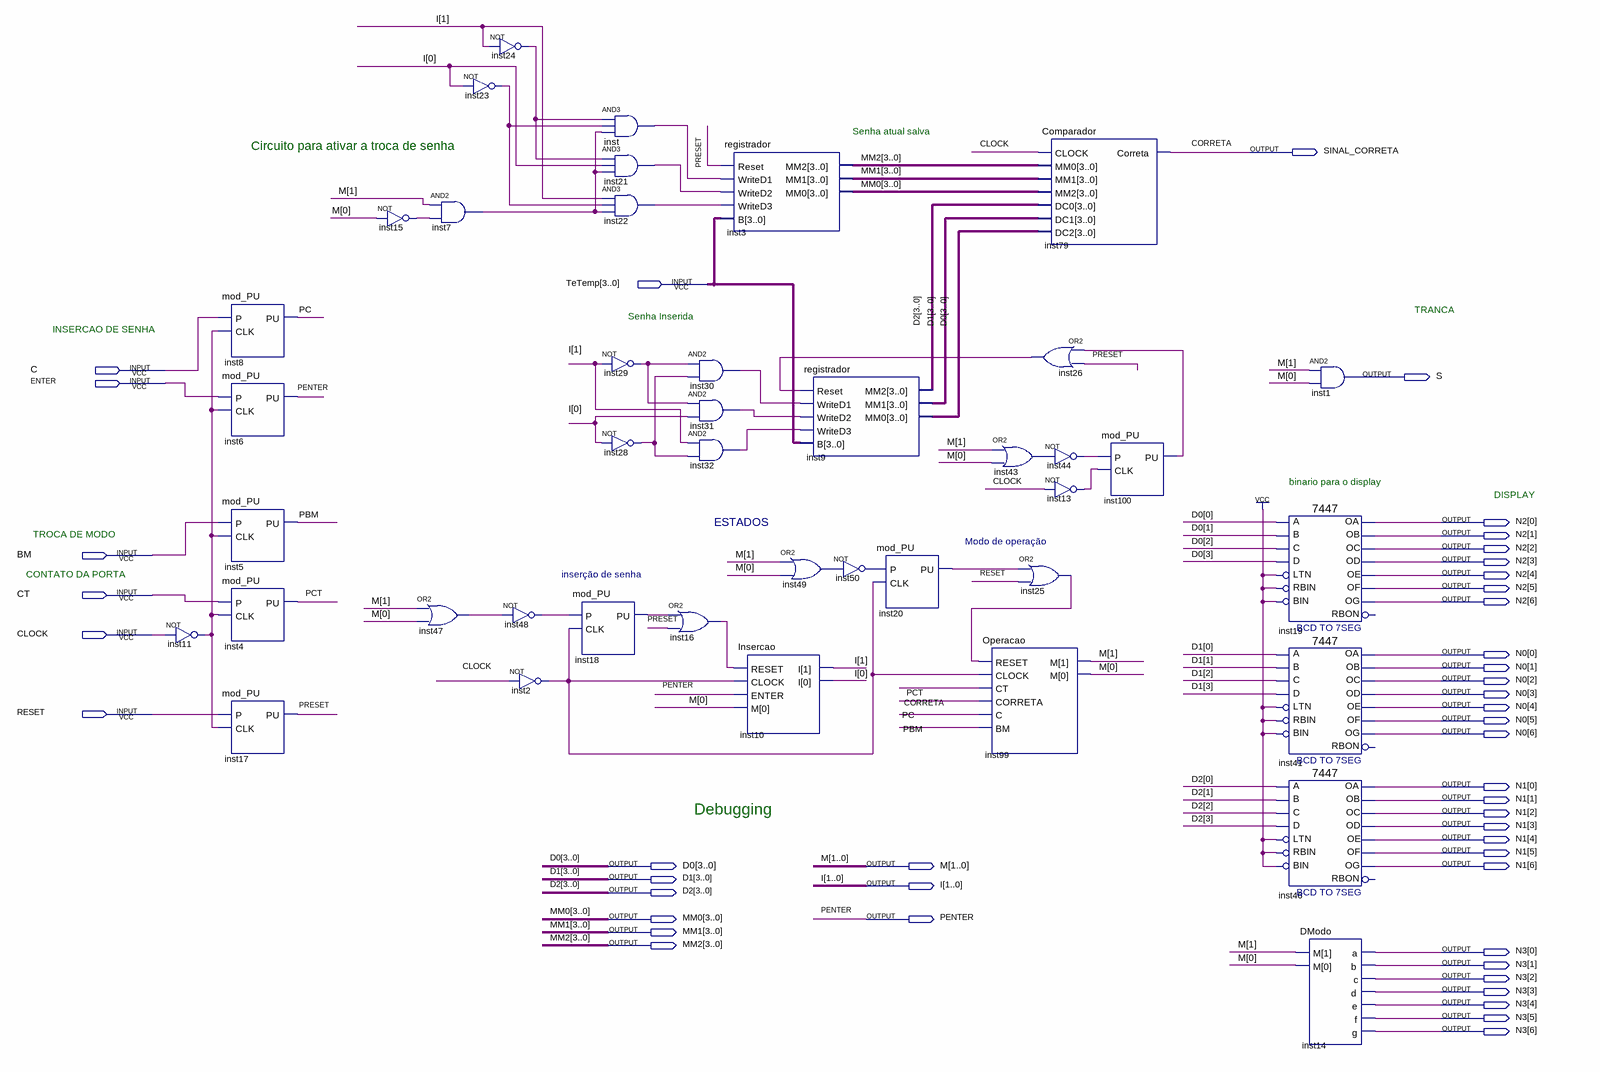
[diagram p0: schematic sheet]
// Quartus schematic Cofre.bdf as structural Verilog: 42 symbols, 46 pins
module Cofre (
  input  [3:0] TeTemp,
  input  C,
  input  ENTER,
  input  BM,
  input  CT,
  input  CLOCK,
  input  RESET,
  output SINAL_CORRETA,
  output S,
  output [6:0] N2,
  output [6:0] N0,
  output [6:0] N1,
  output [3:0] D0,
  output [1:0] M,
  output [3:0] D1,
  output [1:0] I,
  output [3:0] D2,
  output [3:0] MM0,
  output PENTER,
  output [3:0] MM1,
  output [3:0] MM2,
  output [6:0] N3
);

  wire inst2_out, inst7_out, inst11_out, inst13_out, inst15_out, inst16_out, inst18_pu, inst20_pu,
       inst21_out, inst22_out, inst23_out, inst24_out, inst25_out, inst26_out, inst28_out, inst29_out,
       inst30_out, inst31_out, inst32_out, inst43_out, inst44_out, inst47_out, inst48_out, inst49_out,
       inst50_out, inst100_pu, inst_out, PBM, PC, PCT, PRESET;

  not inst11 (inst11_out, CLOCK);
  mod_PU inst8 (.P(C), .CLK(inst11_out), .PU(PC));
  mod_PU inst6 (.P(ENTER), .CLK(inst11_out), .PU(PENTER));
  mod_PU inst5 (.P(BM), .CLK(inst11_out), .PU(PBM));
  mod_PU inst4 (.P(CT), .CLK(inst11_out), .PU(PCT));
  mod_PU inst17 (.P(RESET), .CLK(inst11_out), .PU(PRESET));
  not inst15 (inst15_out, M[0]);
  and inst7 (inst7_out, M[1], inst15_out);
  or inst47 (inst47_out, M[1], M[0]);
  not inst24 (inst24_out, I[1]);
  not inst23 (inst23_out, I[0]);
  not inst48 (inst48_out, inst47_out);
  not inst2 (inst2_out, CLOCK);
  and inst (inst_out, inst24_out, inst23_out, inst7_out);
  and inst21 (inst21_out, inst24_out, I[0], inst7_out);
  and inst22 (inst22_out, I[1], inst23_out, inst7_out);
  not inst29 (inst29_out, I[1]);
  not inst28 (inst28_out, I[0]);
  mod_PU inst18 (.P(inst48_out), .CLK(inst2_out), .PU(inst18_pu));
  and inst30 (inst30_out, inst29_out, inst28_out);
  and inst31 (inst31_out, inst29_out, I[0]);
  and inst32 (inst32_out, I[1], inst28_out);
  or inst16 (inst16_out, inst18_pu, PRESET);
  registrador inst3 (
    .Reset(PRESET), .WriteD1(inst_out), .WriteD2(inst21_out), .WriteD3(inst22_out), .B(TeTemp), .MM2(MM2),
    .MM1(MM1), .MM0(MM0));
  Insercao inst10 (.RESET(inst16_out), .CLOCK(inst2_out), .ENTER(PENTER), .M(M[0]), .I(I));
  registrador inst9 (
    .Reset(inst26_out), .WriteD1(inst30_out), .WriteD2(inst31_out), .WriteD3(inst32_out), .B(TeTemp),
    .MM2(D2), .MM1(D1), .MM0(D0));
  or inst49 (inst49_out, M[1], M[0]);
  mod_PU inst20 (.P(inst50_out), .CLK(inst2_out), .PU(inst20_pu));
  not inst50 (inst50_out, inst49_out);
  Operacao inst99 (.RESET(inst25_out), .CLOCK(inst2_out), .CT(PCT), .CORRETA(SINAL_CORRETA), .C(PC), .BM(PBM), .M(M));
  or inst26 (inst26_out, inst100_pu, PRESET);
  or inst43 (inst43_out, M[1], M[0]);
  or inst25 (inst25_out, inst20_pu, RESET);
  Comparador inst79 (
    .CLOCK(CLOCK), .MM0(MM2), .MM1(MM1), .MM2(MM0), .DC0(D2), .DC1(D1), .DC2(D0), .Correta(SINAL_CORRETA));
  not inst44 (inst44_out, inst43_out);
  not inst13 (inst13_out, CLOCK);
  mod_PU inst100 (.P(inst44_out), .CLK(inst13_out), .PU(inst100_pu));
  \7447  inst19 (
    .LTN(1'b1), .B(D0[1]), .C(D0[2]), .D(D0[3]), .RBIN(1'b1), .BIN(1'b1), .A(D0[0]), .OB(N2[1]), .OC(N2[2]),
    .OE(N2[4]), .OD(N2[3]), .OF(N2[5]), .OG(N2[6]), .OA(N2[0]));  // open: RBON
  \7447  inst41 (
    .LTN(1'b1), .B(D1[1]), .C(D1[2]), .D(D1[3]), .RBIN(1'b1), .BIN(1'b1), .A(D1[0]), .OB(N0[1]), .OC(N0[2]),
    .OE(N0[4]), .OD(N0[3]), .OF(N0[5]), .OG(N0[6]), .OA(N0[0]));  // open: RBON
  \7447  inst46 (
    .LTN(1'b1), .B(D2[1]), .C(D2[2]), .D(D2[3]), .RBIN(1'b1), .BIN(1'b1), .A(D2[0]), .OB(N1[1]), .OC(N1[2]),
    .OE(N1[4]), .OD(N1[3]), .OF(N1[5]), .OG(N1[6]), .OA(N1[0]));  // open: RBON
  DModo inst14 (.M(M), .a(N3[0]), .b(N3[1]), .c(N3[2]), .d(N3[3]), .e(N3[4]), .f(N3[5]), .g(N3[6]));
  and inst1 (S, M[1], M[0]);

  // Other names for the same wires on the sheet: CORRETA = SINAL_CORRETA

  // Notes on the sheet:
  //   Senha atual salva
  //   Circuito para ativar a troca de senha
  //   TRANCA
  //   Senha Inserida
  //   INSERCAO DE SENHA
  //   binario para o display
  //   DISPLAY
  //   ESTADOS
  //   TROCA DE MODO
  //   Modo de operação
  //   CONTATO DA PORTA
  //   inserção de senha
  //   Debugging
endmodule
